# EAGLE schematic brick_i2c_9axis_MPU9250 (EAGLE 7.4.0)
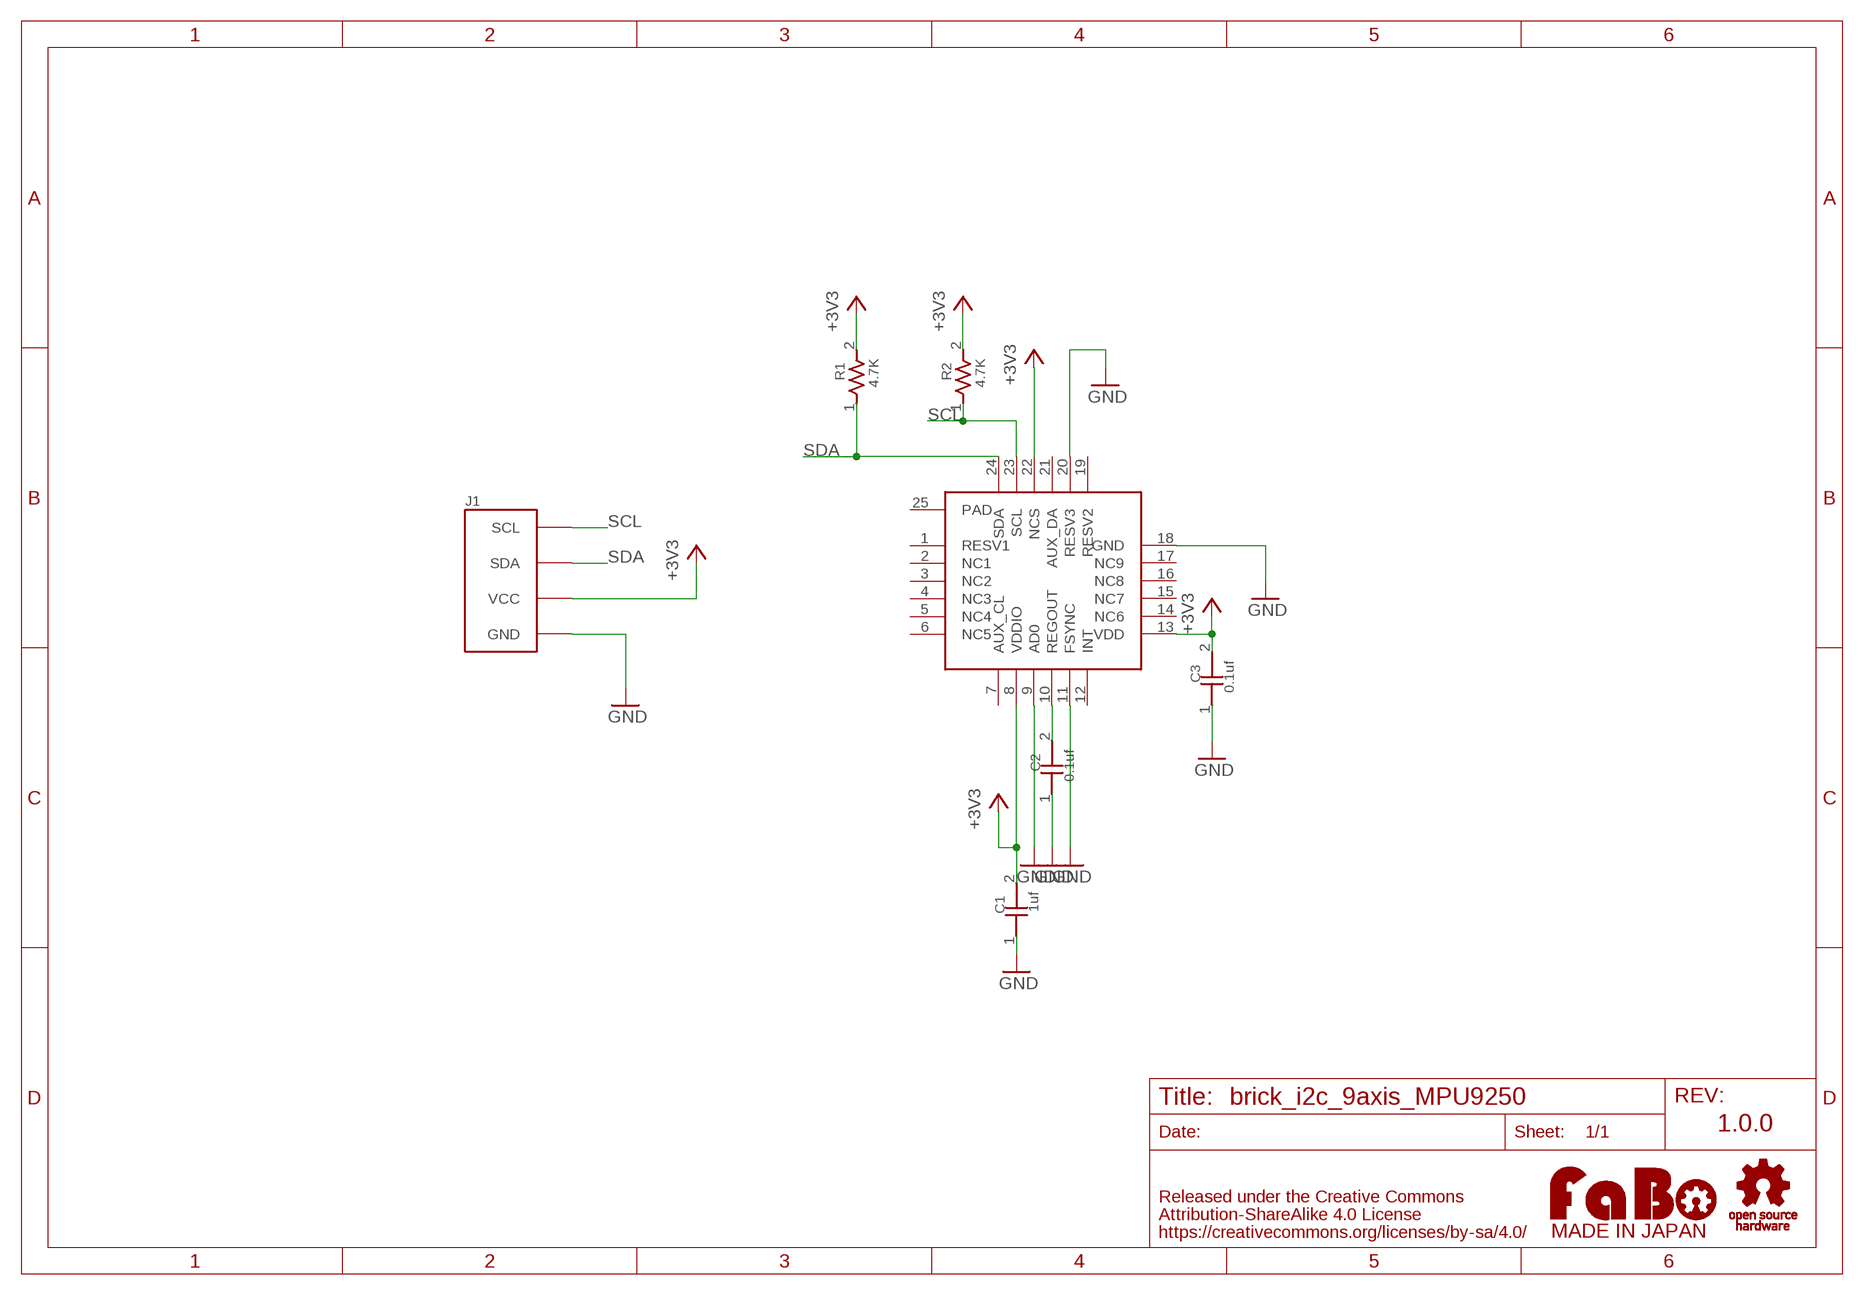
[diagram p0: schematic, sheet 1]

## Parts
C1  1uf  CAPACITOR0603  [0603]
C2  0.1uf  CAPACITOR0603  [0603]
C3  0.1uf  CAPACITOR0603  [0603]
J1  BRICK_I2C  [BRICK_I2C]
R1  4.7K  RESISTOR0603  [0603]
R2  4.7K  RESISTOR0603  [0603]
U$1  INVENSENSE-MPU9250  [LGA-24]
U$3  LOGO_FABO-M  [LOGO_FABO_M]
U$5  LOGO_OSHW_T-M  [LOGO_OSHW_T_M]

## Nets
+3V3: C1.2 C3.2 J1.VCC R1.2 R2.2 U$1.8(VDDIO) U$1.13(VDD) U$1.22(NCS)
GND: C1.1 C2.1 C3.1 J1.GND U$1.9(AD0) U$1.11(FSYNC) U$1.18(GND) U$1.20(RESV3)
N$3: C2.2 U$1.10(REGOUT)
SCL: J1.SCL R2.1 U$1.23(SCL)
SDA: J1.SDA R1.1 U$1.24(SDA)
Unconnected: U$1.1(RESV1) U$1.2(NC1) U$1.3(NC2) U$1.4(NC3) U$1.5(NC4) U$1.6(NC5) U$1.7(AUX_CL) U$1.12(INT) U$1.14(NC6) U$1.15(NC7) U$1.16(NC8) U$1.17(NC9) U$1.19(RESV2) U$1.21(AUX_DA) U$1.25(PAD)

## Notes on the sheet
- 1.0.0

## Library data of the parts
C1-C3 = GClue-Capacitor:CAPACITOR
J1 = gclue:BRICK_I2C: FaBo Brick 4pin(I2C)
R1 R2 = GClue-Resistors:RESISTOR
U$1 = GClue-Mems:INVENSENSE-MPU9250
U$3 = FaBo-etc:LOGO_FABO
U$5 = gclue:LOGO_OSHW_T